# EAGLE schematic Final v3 (EAGLE 9.7.0)
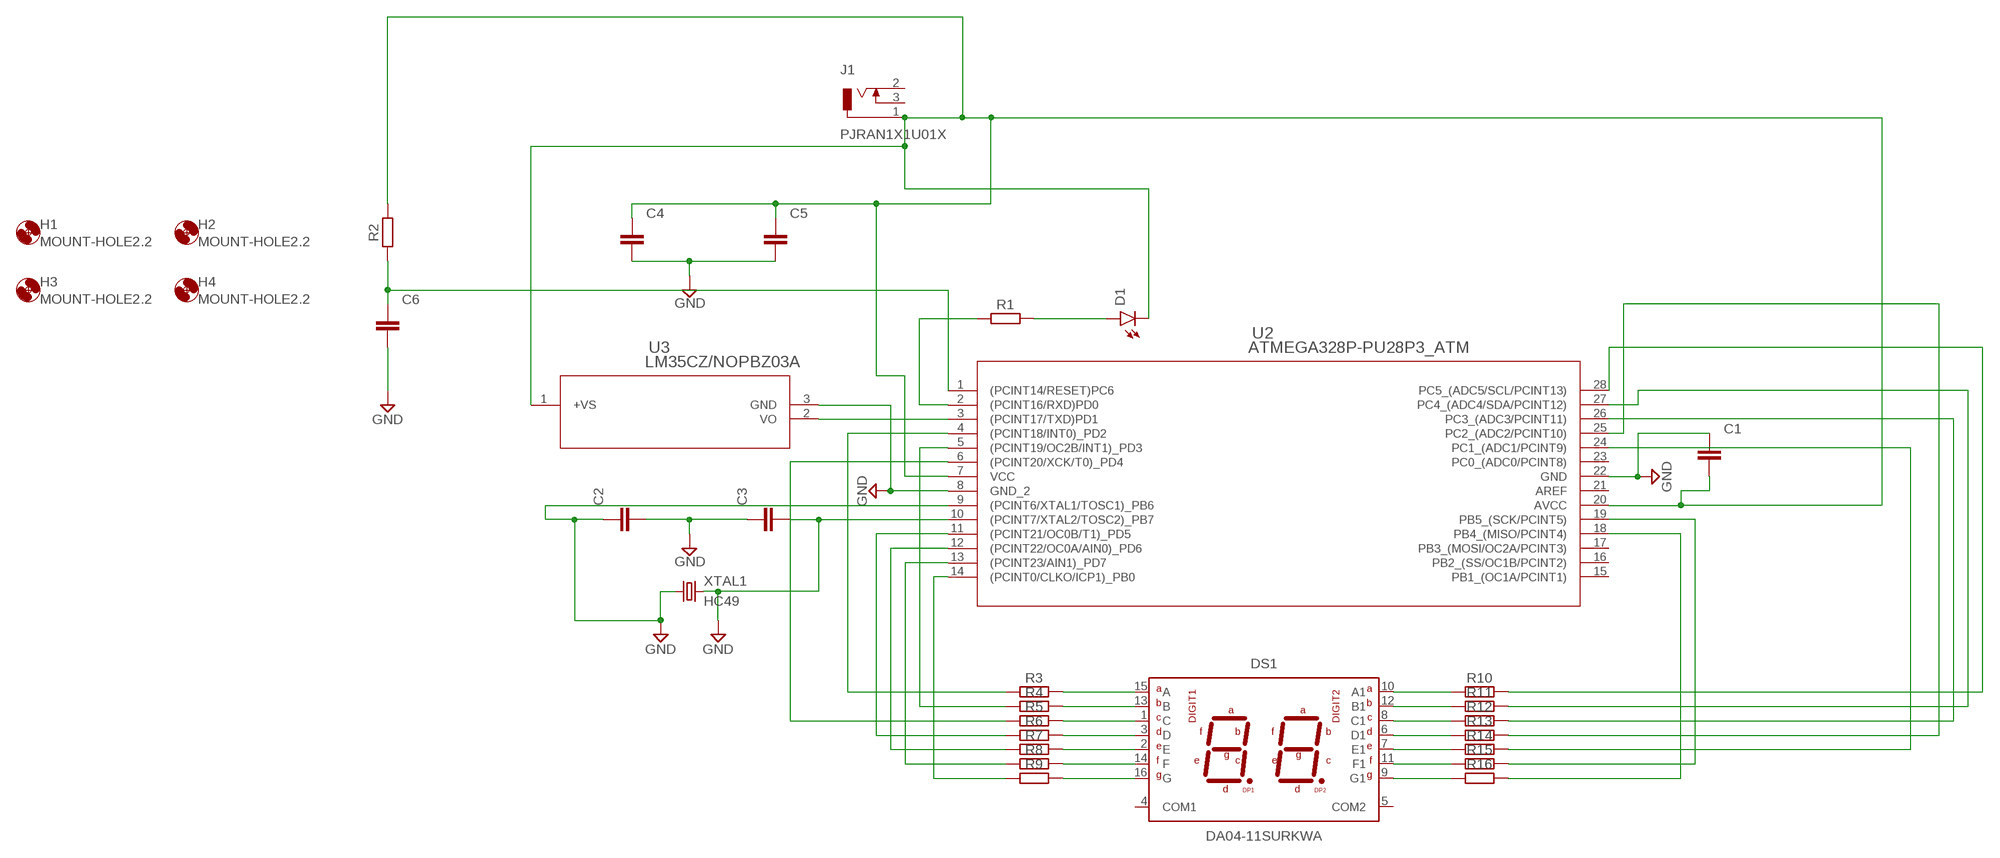
[diagram p0: schematic, sheet 1]

## Parts
C1  C_RADIAL-12.5MM-DIA  [CAPRD550W60D1025H1250B]
C2  C_RADIAL-12.5MM-DIA  [CAPRD550W60D1025H1250B]
C3  C_RADIAL-12.5MM-DIA  [CAPRD550W60D1025H1250B]
C4  C_RADIAL-12.5MM-DIA  [CAPRD550W60D1025H1250B]
C5  C_RADIAL-12.5MM-DIA  [CAPRD550W60D1025H1250B]
C6  C_RADIAL-12.5MM-DIA  [CAPRD550W60D1025H1250B]
D1  LED_RADIALGREEN  [LEDGR254W60D565H860B_Y]
DS1  DA04-11SURKWA  [D*04-11SURKWA]
H1  MOUNT-HOLE2.2  [2,2]
H2  MOUNT-HOLE2.2  [2,2]
H3  MOUNT-HOLE2.2  [2,2]
H4  MOUNT-HOLE2.2  [2,2]
J1  PJRAN1X1U01X  [PJRAN1X1U01X]
R1  R_AXIAL-7.2MM-PITCH  [RESAD724W46L381D178B]
R2  R_AXIAL-7.2MM-PITCH  [RESAD724W46L381D178B]
R3  R_AXIAL-7.2MM-PITCH  [RESAD724W46L381D178B]
R4  R_AXIAL-7.2MM-PITCH  [RESAD724W46L381D178B]
R5  R_AXIAL-7.2MM-PITCH  [RESAD724W46L381D178B]
R6  R_AXIAL-7.2MM-PITCH  [RESAD724W46L381D178B]
R7  R_AXIAL-7.2MM-PITCH  [RESAD724W46L381D178B]
R8  R_AXIAL-7.2MM-PITCH  [RESAD724W46L381D178B]
R9  R_AXIAL-7.2MM-PITCH  [RESAD724W46L381D178B]
R10  R_AXIAL-7.2MM-PITCH  [RESAD724W46L381D178B]
R11  R_AXIAL-7.2MM-PITCH  [RESAD724W46L381D178B]
R12  R_AXIAL-7.2MM-PITCH  [RESAD724W46L381D178B]
R13  R_AXIAL-7.2MM-PITCH  [RESAD724W46L381D178B]
R14  R_AXIAL-7.2MM-PITCH  [RESAD724W46L381D178B]
R15  R_AXIAL-7.2MM-PITCH  [RESAD724W46L381D178B]
R16  R_AXIAL-7.2MM-PITCH  [RESAD724W46L381D178B]
U2  ATMEGA328P-PU28P3_ATM  [28P3_ATM]
U3  LM35CZ/NOPBZ03A  [Z03A]
XTAL1  HC49  CRYSTAL_HC49-11.5L  [XTALRR488W45L1150T500H350B]

## Nets
GND: C1.1 C2.1 C2.2 C3.1 C3.2 C4.2 C5.2 C6.2 U2.8(GND_2) U2.9((PCINT6/XTAL1/TOSC1)_PB6) U2.10((PCINT7/XTAL2/TOSC2)_PB7) U2.22(GND) U3.3(GND) XTAL1.1 XTAL1.2
N$1: U2.3((PCINT17/TXD)PD1) U3.2(VO)
N$3: C6.1 R2.1 U2.1((PCINT14/RESET)PC6)
N$4: R1.1 U2.2((PCINT16/RXD)PD0)
N$5: D1.1(A) R1.2
N$7: C1.2 C4.1 C5.1 D1.2(C) J1.1 R2.2 U2.7(VCC) U2.20(AVCC) U3.1(+VS)
N$8: R3.1 U2.4((PCINT18/INT0)_PD2)
N$9: R4.1 U2.5((PCINT19/OC2B/INT1)_PD3)
N$10: R5.1 U2.6((PCINT20/XCK/T0)_PD4)
N$11: R6.1 U2.11((PCINT21/OC0B/T1)_PD5)
N$12: R7.1 U2.12((PCINT22/OC0A/AIN0)_PD6)
N$13: R8.1 U2.13((PCINT23/AIN1)_PD7)
N$14: R9.1 U2.14((PCINT0/CLKO/ICP1)_PB0)
N$15: DS1.15(A) R3.2
N$16: DS1.13(B) R4.2
N$17: DS1.1(C) R5.2
N$18: DS1.3(D) R6.2
N$19: DS1.2(E) R7.2
N$20: DS1.14(F) R8.2
N$21: DS1.16(G) R9.2
N$22: DS1.10(A1) R10.1
N$23: DS1.12(B1) R11.1
N$24: DS1.8(C1) R12.1
N$25: DS1.6(D1) R13.1
N$26: DS1.7(E1) R14.1
N$27: DS1.11(F1) R15.1
N$28: DS1.9(G1) R16.1
N$29: R10.2 U2.28(PC5_(ADC5/SCL/PCINT13))
N$30: R11.2 U2.27(PC4_(ADC4/SDA/PCINT12))
N$31: R12.2 U2.26(PC3_(ADC3/PCINT11))
N$32: R13.2 U2.25(PC2_(ADC2/PCINT10))
N$33: R14.2 U2.24(PC1_(ADC1/PCINT9))
N$34: R15.2 U2.19(PB5_(SCK/PCINT5))
N$35: R16.2 U2.18(PB4_(MISO/PCINT4))
Unconnected: DS1.4(COM1) DS1.5(COM2) J1.2 J1.3 U2.15(PB1_(OC1A/PCINT1)) U2.16(PB2_(SS/OC1B/PCINT2)) U2.17(PB3_(MOSI/OC2A/PCINT3)) U2.21(AREF) U2.23(PC0_(ADC0/PCINT8))

## Library data of the parts
C1 = Capacitor:C: Capacitor - Generic; CATEGORY: Capacitor
C2-C6 = Tutorial - Fusion 360:C: Capacitor - Generic; CATEGORY: Capacitor
D1 = Library:LED_RADIAL: LED - Generic
DS1 = Display_LED:D*04-11SURKWA: Dual Digit Numeric Display - 7SEG, 0.4" Character size, RED, 16DIP, THT Datasheet-DA04-11SURKWA <https://www.kingbrightusa.com/images/catalog/SPEC/DA04-11SURKWA.pdf> Datasheet-DC04-11SURKWA <https://www.kingbrightusa.com/images/catalog/SPEC/DC04-11SURKWA.pdf>; CATEGORY: DISPLAY; COLOR: Hyper Red (AlGaInP); CONFIGURATION: Common Anode; DESCRIPTION: 10 mm (0.4 inch) Dual Digit Numeric Display in Common Anode Configuration; DIGIT: Dual Digit; MANUFACTURER: Kingbright; MPN: DA04-11SURKWA; OPERATING_TEMP: -40°C to +85 °C; PART_STATUS: Active; ROHS_COMPLIANT: COMPLIANT; SERIES: -; SUB-CATEGORY: LED; THERMALLOSS: 0.075 W; TYPE: 7 Segment
H1-H4 = holes:MOUNT-HOLE: MOUNTING HOLE with drill center marker
J1 = Connectors:PJRAN1X1U01X: CONN RCA JACK MONO 3.2MM R/A Manufacturer's datasheet <http://www.switchcraft.com/Drawings/pjran1x1u__x_series_cd.pdf>; CREATED_BY: PCBLayout.com; DIGIKEY_PART_NUMBER: PJRAN1X1U01X-ND; MANUFACTURER: Switchcraft Inc.; MPN: PJRAN1X1U01X
R1-R16 = Resistor:R: Resistor Fixed - Generic; CATEGORY: Resistor; SUB-CATEGORY: Fixed
U2 = ATMega328P-PU:ATMEGA328P-PU; COPYRIGHT: Copyright (C) 2022 Ultra Librarian. All rights reserved.; MANUFACTURER_PART_NUMBER: ATMEGA328P-PU; MFR_NAME: Microchip
U3 = LM35CZNOPB:LM35CZ/NOPB; COPYRIGHT: Copyright (C) 2022 Ultra Librarian. All rights reserved.; MANUFACTURER_PART_NUMBER: LM35CZ/NOPB; MFR_NAME: Texas Instruments; TYPE: LM35CAZ
XTAL1 = Frequency-Source:CRYSTAL: Crystal 2Pin - Generic; CATEGORY: Frequency-Source; SUB-CATEGORY: Crystal-2Pin